# Altium schematic sheet FRAM.SchDoc
size A4; PageSetup: Record=PageOptions|CenterHorizontal=True|CenterVertical=True|PrintScale=0.99|XCorrection=1.00|YCorrection=1.00|PrintKind=1|BorderSize=5000000|LeftOffset=0|BottomOffset=0|Orientation=1|PaperLength=1000|PaperWidth=1000|Scale=100|PaperSource=15|PrintQuality=600|MediaType=1|DitherType=10|PrintScaleMode=1|PaperKind=A4|PaperIndex=9
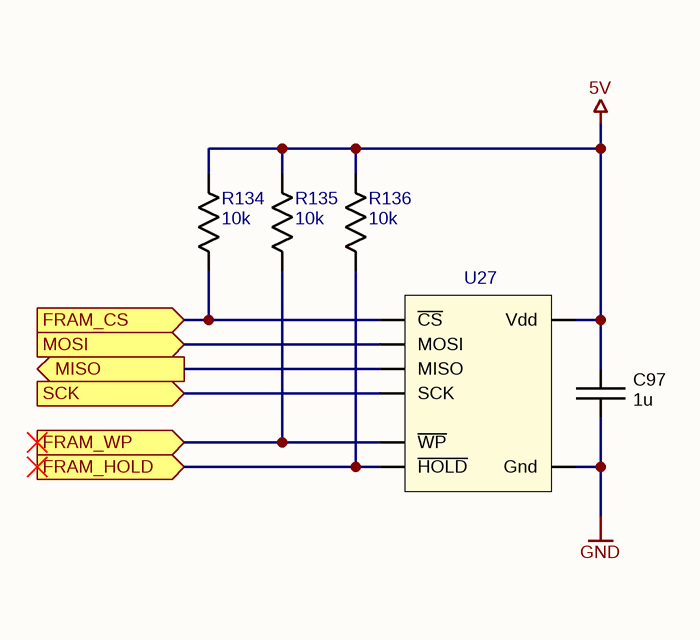
[diagram p0: FRAM.SchDoc]

## Parts
C97  1u  [CAP CER 0603 NP]
R134  10k  [RES 0603]
R135  10k  [RES 0603]
R136  10k  [RES 0603]
U27  FRAM SPI IC  [SOIC-8]  (value not drawn)

## Ports
FRAM_CS, FRAM_HOLD, FRAM_WP, MISO, MOSI, SCK

## Nets
5V: C97.1 R134.2 R135.2 R136.2 U27.8(Vdd)
GND: C97.2 U27.4(Gnd)
FRAM_CS: R134.1 U27.1(~{CS}) ; port FRAM_CS
FRAM_HOLD: R136.1 U27.7(~{HOLD}) ; port FRAM_HOLD
FRAM_WP: R135.1 U27.3(~{WP}) ; port FRAM_WP
MISO: U27.2(MISO) ; port MISO
MOSI: U27.5(MOSI) ; port MOSI
SCK: U27.6(SCK) ; port SCK

## Library data of the parts
C97 = Capacitor: CC0603KRX5R7BB105
R134-R136 = Resistor: RC0603FR-0710KL
U27 = MB85RS64V: MB85RS64VPNF-G-JNERE1